# EAGLE design LedRing (EAGLE 6.5.0)
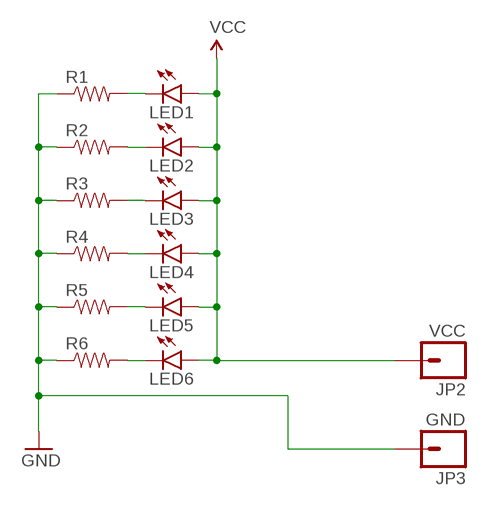
[diagram p0: schematic, sheet 1]

## Parts
JP2  VCC  M01NOSILK-KIT  [1X01NS-KIT]
JP3  GND  M01NOSILK-KIT  [1X01NS-KIT]
LED1  LED1206  [LED-1206]
LED2  LED1206  [LED-1206]
LED3  LED1206  [LED-1206]
LED4  LED1206  [LED-1206]
LED5  LED1206  [LED-1206]
LED6  LED1206  [LED-1206]
R1  RESISTOR1206  [1206]
R2  RESISTOR1206  [1206]
R3  RESISTOR1206  [1206]
R4  RESISTOR1206  [1206]
R5  RESISTOR1206  [1206]
R6  RESISTOR1206  [1206]

## Nets
GND: JP3.1 R1.1 R2.1 R3.1 R4.1 R5.1 R6.1
N$1: LED1.C R1.2
N$2: LED2.C R2.2
N$3: LED3.C R3.2
N$4: LED4.C R4.2
N$5: LED5.C R5.2
N$6: LED6.C R6.2
VCC: JP2.1 LED1.A LED2.A LED3.A LED4.A LED5.A LED6.A

## Library data of the parts
JP2 JP3 = SparkFun-Connectors:M01: Header 1 Standard 1-pin 0.1" header. Use with straight break away headers (SKU : PRT-00116), right angle break away headers (PRT-00553), swiss pins (PRT-00743), machine pins (PRT-00117), and female headers (PRT-00115).
LED1-LED6 = SparkFun-LED:LED: LEDs Standard schematic elements and footprints for 5mm, 3mm, 1206, and 0603 sized LEDs. 5mm - Spark Fun Electronics SKU : COM-00529 (and others)
R1-R6 = SparkFun-Passives:RESISTOR: Resistor Basic schematic elements and footprints for 0603, 1206, and PTH resistors.

## Board
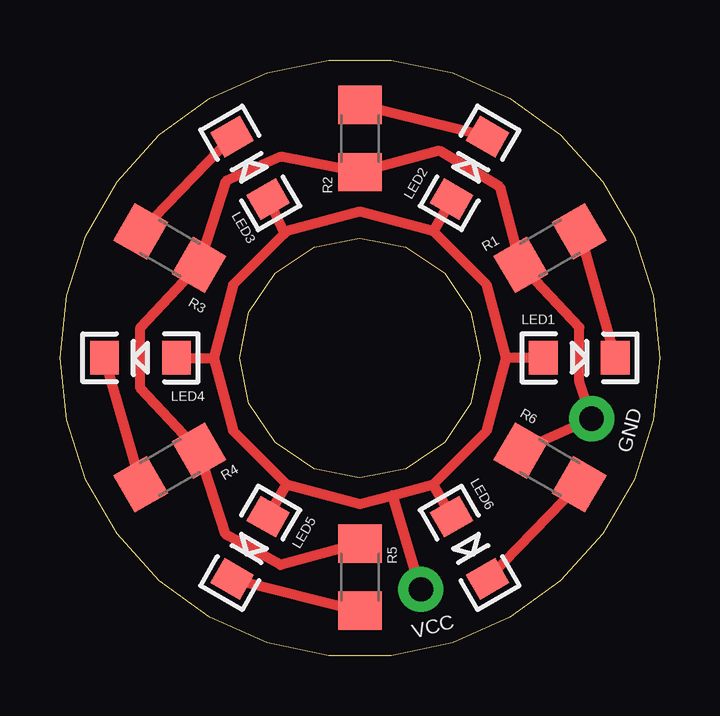
[diagram p1: board, top side]

Size 24.99 x 24.84 mm. Coordinates in mm from the lower left corner, seen from the top.
Outline: 0,12.42 0.28,15.01 1.07,17.5 2.39,19.76 4.14,21.72 6.25,23.24 8.64,24.31 11.2,24.84 13.79,24.84 16.36,24.31 18.74,23.24 20.85,21.72 22.61,19.76 23.93,17.5 24.71,15.01 24.99,12.42 24.71,9.83 23.93,7.34 22.61,5.08 20.85,3.12 18.74,1.6 16.36,0.53 13.79,0 11.2,0 8.64,0.53 6.25,1.6 4.14,3.12 2.39,5.08 1.07,7.34 0.28,9.83 0,12.42
Outline: 7.49,12.42 7.87,14.33 8.97,15.95 10.59,17.04 12.5,17.42 14.4,17.04 16.03,15.95 17.12,14.33 17.5,12.42 17.12,10.52 16.03,8.89 14.4,7.8 12.5,7.42 10.59,7.8 8.97,8.89 7.87,10.52 7.49,12.42
Copper layers (1*16): Top 0.035mm / dielectric 1.5mm / Bottom 0.035mm
Design rules "dirt_cheap_dirty_boards.v1": minimum track width 5mil, minimum drill 12mil, track to track 5mil, track to pad 5mil, pad to pad 5mil, via to via 5mil, smd to smd 0mil, copper to edge 10mil, drill to drill 10mil, minimum pad ring 10mil, minimum via ring 6mil, stop-mask expansion 2mil, vias tented up to drill 25mil, thermal gap 10mil

### Footprints (pad centres in the part's own frame; a part is rotated, then mirrored left to right if it is on the bottom)
1X01NS-KIT = drill 1.016 pad 1.88: 1 0,0
LED-1206 = smd 1.2 x 1.4: A -1.5,0; C 1.5,0
1206 = smd 1.6 x 1.8: 1 -1.4,0; 2 1.4,0

### Placement (x,y rotation side)
JP2  15.04,2.77 195 top
JP3  22.15,9.88 255 top
LED1  21.64,12.42 0 top
LED2  17.07,20.34 60 top
LED3  7.92,20.34 120 top
LED4  3.35,12.42 180 top
LED5  7.92,4.5 240 top
LED6  17.07,4.5 300 top
R1  20.42,16.99 30 top
R2  12.5,21.56 90 top
R3  4.58,16.99 150 top
R4  4.58,7.85 210 top
R5  12.5,3.28 270 top
R6  20.42,7.85 330 top

### Tracks (layer width: path | path; a pad name or v marks a point on that pad's centre or on a via)
GND
  Top 0.406: R5.1 9.19,3.78 6.91,5.05 R4.1 3.35,11.15 3.35,13.69 R3.1 6.91,19.79 9.19,20.8 R2.1 15.8,21.06 18.34,19.53 R1.1 21.64,13.69 21.64,11.4 JP3.1 R6.1
N$1
  Top 0.406: R1.2 LED1.C
N$2
  Top 0.406: LED2.C R2.2
N$3
  Top 0.406: LED3.C R3.2
N$4
  Top 0.406: LED4.C R4.2
N$5
  Top 0.406: LED5.C R5.2
N$6
  Top 0.406: LED6.C R6.2
VCC
  Top 0.406: 18.59,12.42 17.78,15.47 15.54,17.7 | 15.54,17.7 12.5,18.52 9.45,17.7 9.35,17.6 | 9.35,17.6 7.22,15.47 6.4,12.42 | 6.4,12.42 7.22,9.37 9.45,7.14 | 9.45,7.14 12.5,6.32 13.85,6.69 | 13.85,6.69 15.54,7.14 | 15.54,7.14 17.78,9.37 18.59,12.42 | LED3.A 9.35,17.6 | LED2.A 15.54,17.7 | LED1.A 18.59,12.42 | LED6.A 15.54,7.14 | LED4.A 6.4,12.42 | LED5.A 9.45,7.14 | JP2.1 13.85,6.69

### Text on the board
tNames: GND | VCC
bNames: led ring | noti, 2015